# EAGLE design ProtoMole5 (EAGLE 6.6.0)
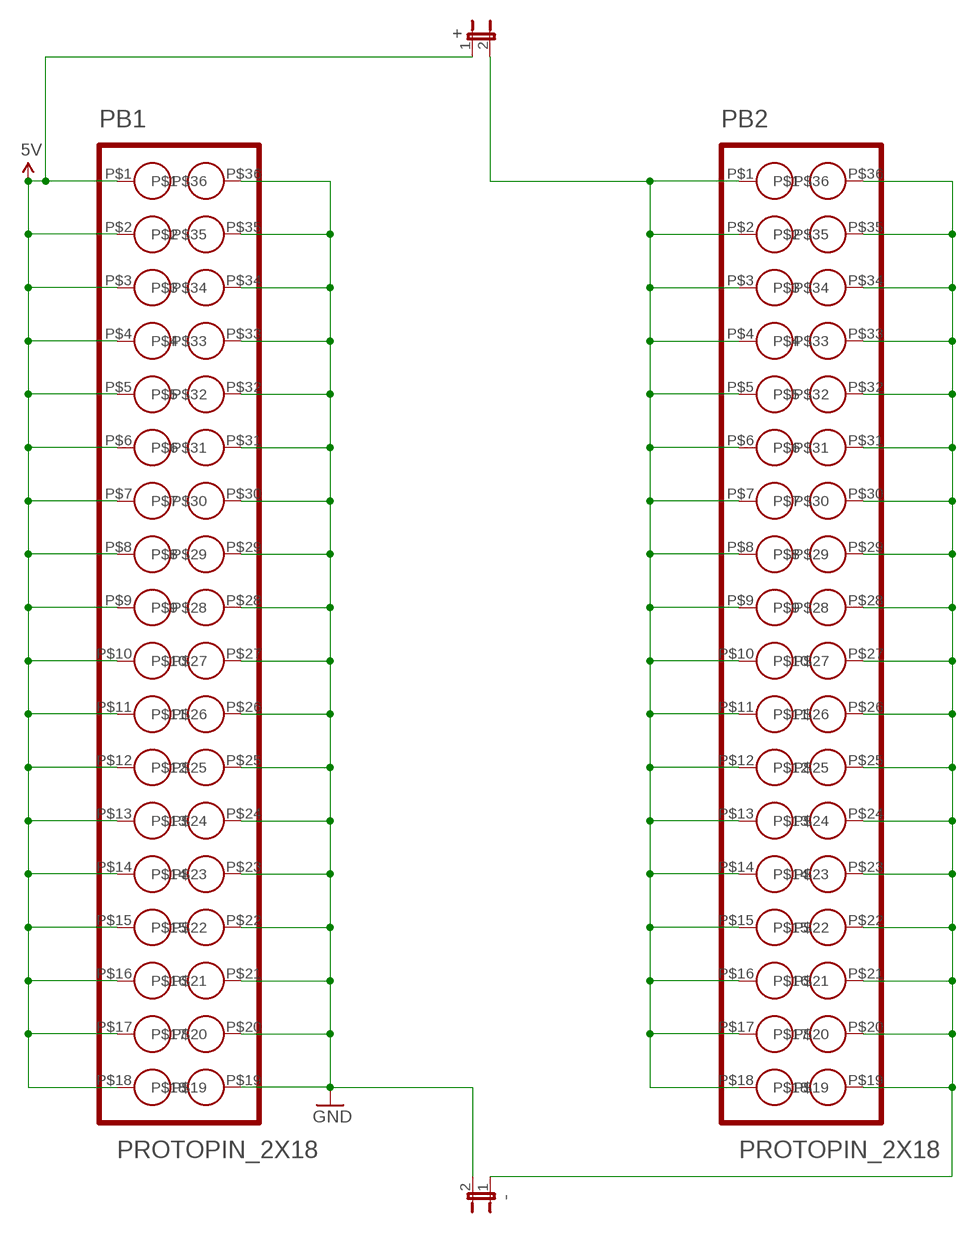
[diagram p0: schematic, sheet 1]

## Parts
+  JUMPER-2SMD-NO-NS  [SJ_2S-NO-NS]
-  JUMPER-2SMD-NO-NS  [SJ_2S-NO-NS]
PB1  PROTOPIN_2X18  [2X18_PINHEADER]
PB2  PROTOPIN_2X18  [2X18_PINHEADER]

## Nets
5V: +.1 PB1.P$1 PB1.P$2 PB1.P$3 PB1.P$4 PB1.P$5 PB1.P$6 PB1.P$7 PB1.P$8 PB1.P$9 PB1.P$10 PB1.P$11 PB1.P$12 PB1.P$13 PB1.P$14 PB1.P$15 PB1.P$16 PB1.P$17 PB1.P$18
GND: -.2 PB1.P$19 PB1.P$20 PB1.P$21 PB1.P$22 PB1.P$23 PB1.P$24 PB1.P$25 PB1.P$26 PB1.P$27 PB1.P$28 PB1.P$29 PB1.P$30 PB1.P$31 PB1.P$32 PB1.P$33 PB1.P$34 PB1.P$35 PB1.P$36
N$181: -.1 PB2.P$19 PB2.P$20 PB2.P$21 PB2.P$22 PB2.P$23 PB2.P$24 PB2.P$25 PB2.P$26 PB2.P$27 PB2.P$28 PB2.P$29 PB2.P$30 PB2.P$31 PB2.P$32 PB2.P$33 PB2.P$34 PB2.P$35 PB2.P$36
N$185: +.2 PB2.P$1 PB2.P$2 PB2.P$3 PB2.P$4 PB2.P$5 PB2.P$6 PB2.P$7 PB2.P$8 PB2.P$9 PB2.P$10 PB2.P$11 PB2.P$12 PB2.P$13 PB2.P$14 PB2.P$15 PB2.P$16 PB2.P$17 PB2.P$18

## Library data of the parts
+ - = SparkFun-Retired:JUMPER-2: Jumper Basic 0.1" spaced jumper. Use with breakaway headers.
PB1 PB2 = MarcEagleParts:PROTOPIN_2X18

## Board
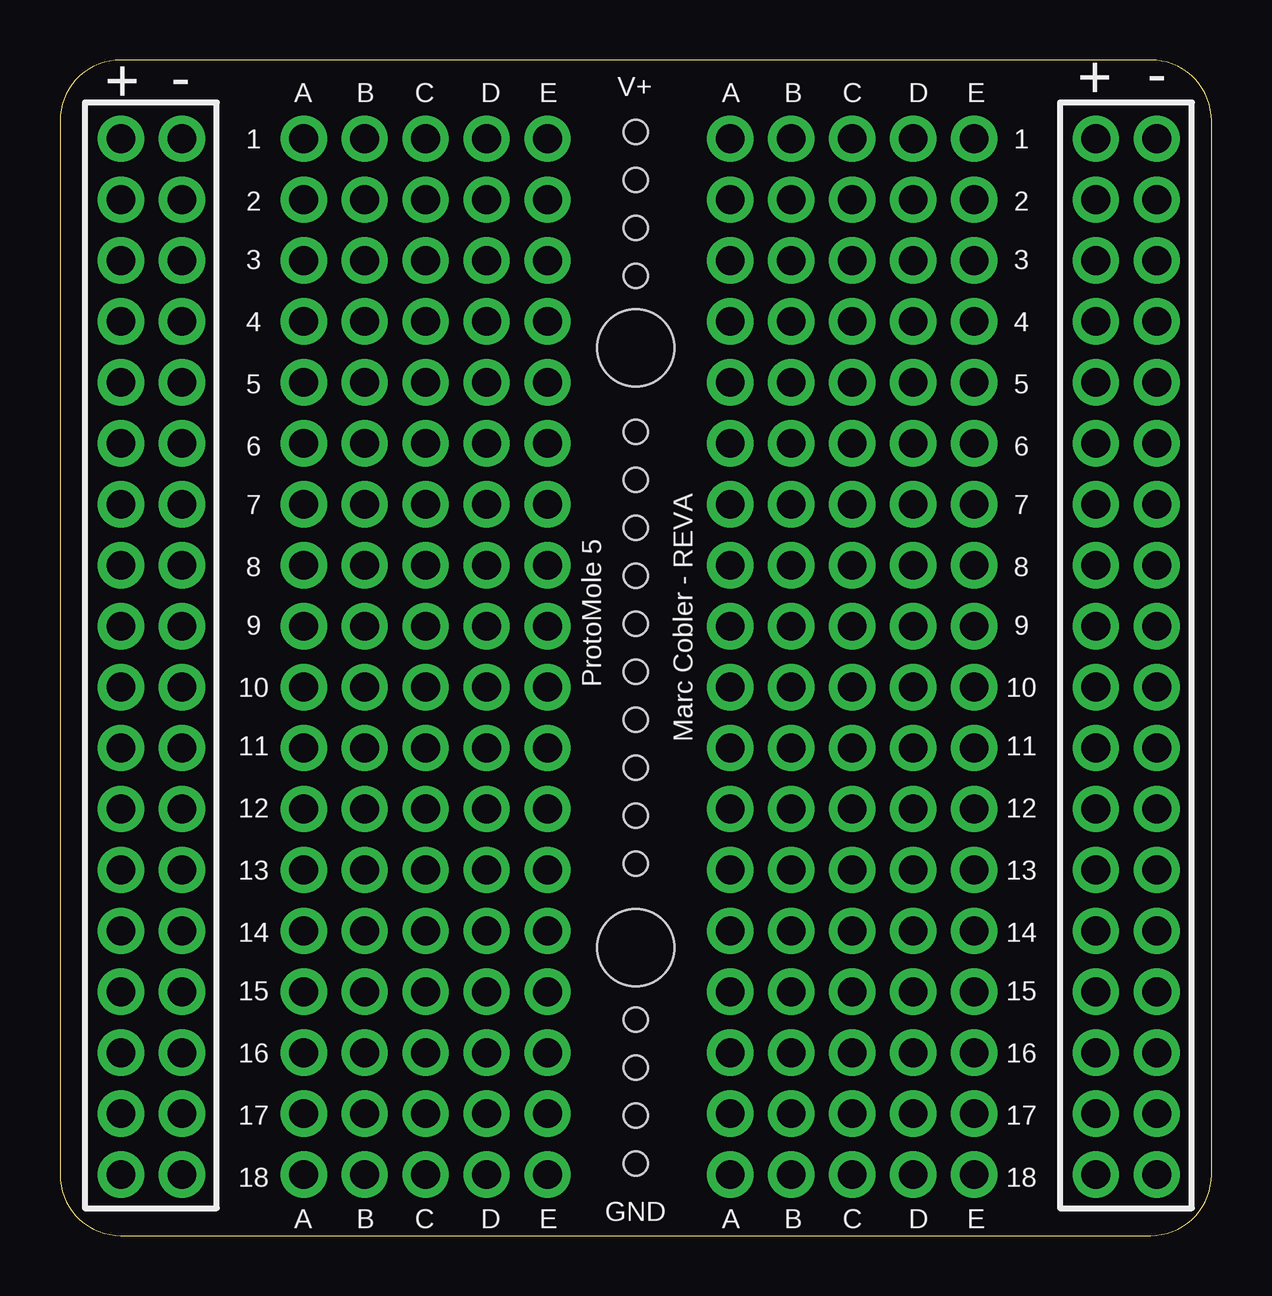
[diagram p1: board, top side]
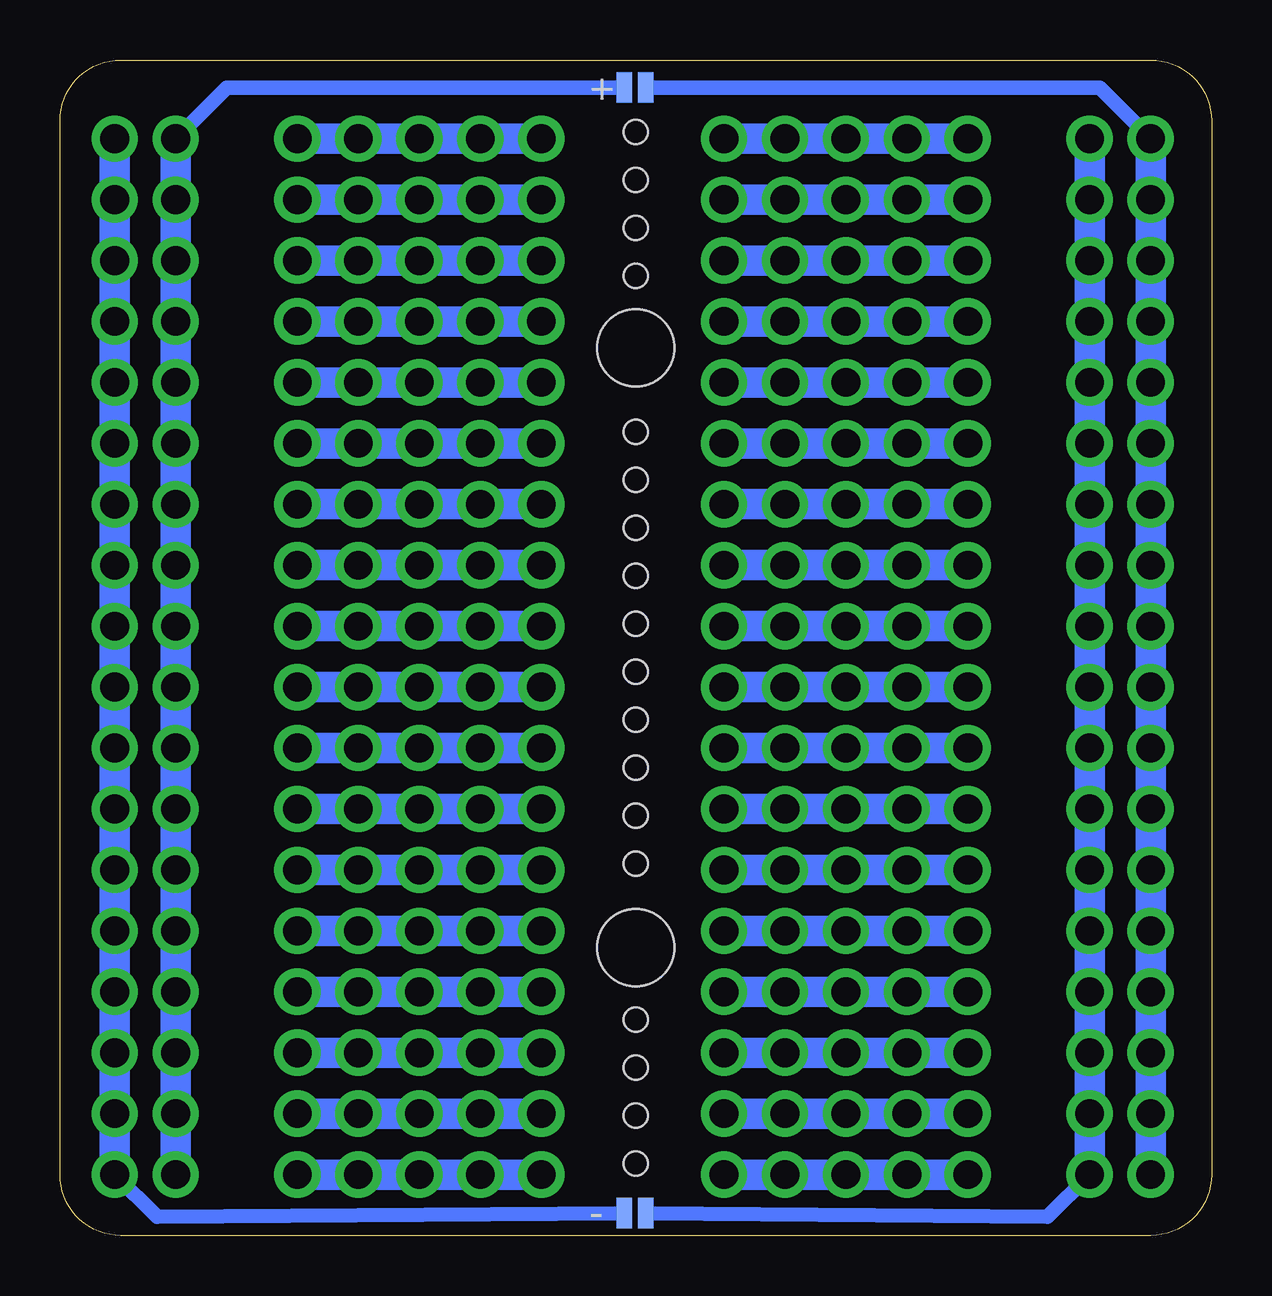
[diagram p2: board, bottom side, seen from below]

Size 48 x 49 mm. Coordinates in mm from the lower left corner, seen from the top.
Outline: 0,46.46 0,2.54 arc90 2.54,0 45.46,0 arc90 48,2.54 48,46.46 arc90 45.46,49 2.54,49 arc90 0,46.46
Copper layers (1*16): Top 0.035mm / dielectric 1.5mm / Bottom 0.035mm
Design rules "ITEADstudio_DRC": minimum track width 6mil, minimum drill 12mil, track to track 6mil, track to pad 6mil, pad to pad 6mil, via to via 6mil, smd to smd 0mil, copper to edge 10mil, drill to drill 10mil, minimum pad ring 10mil, minimum via ring 6mil, stop-mask expansion 2mil, vias tented up to drill 100mil, thermal gap 10mil
Holes 1 mm at 24,42 24,17.5 24,15.5 24,9 24,7 24,44 24,46 24,33.5 24,31.5 24,29.5 24,27.5 24,25.5 24,23.5 24,21.5 24,19.5 24,5 24,3 24,40
Holes 3.2 mm at 24,12 24,37

### Footprints (pad centres in the part's own frame; a part is rotated, then mirrored left to right if it is on the bottom)
SJ_2S-NO-NS = smd 0.635 x 1.27: 1 -0.45,0; 2 0.45,0
2X18_PINHEADER = drill 1.2 pad 1.93: P$1 0,0; P$2 2.54,0; P$3 5.08,0; P$4 7.62,0; P$5 10.16,0; P$6 12.7,0; P$7 15.24,0; P$8 17.78,0; P$9 20.32,0; P$10 22.86,0; P$11 25.4,0; P$12 27.94,0; P$13 30.48,0; P$14 33.02,0; P$15 35.56,0; P$16 38.1,0; P$17 40.64,0; P$18 43.18,0; P$19 0,2.54; P$20 2.54,2.54; P$21 5.08,2.54; P$22 7.62,2.54; P$23 10.16,2.54; P$24 12.7,2.54; P$25 15.24,2.54; P$26 17.78,2.54; P$27 20.32,2.54; P$28 22.86,2.54; P$29 25.4,2.54; P$30 27.94,2.54; P$31 30.48,2.54; P$32 33.02,2.54; P$33 35.56,2.54; P$34 38.1,2.54; P$35 40.64,2.54; P$36 43.18,2.54

### Placement (x,y rotation side)
+  24.03,47.85 180 bottom
-  24.03,0.93 0 bottom
PB1  2.54,45.72 270 top
PB2  43.18,45.72 270 top

### Tracks (layer width: path | path; a pad name or v marks a point on that pad's centre or on a via)
1  (via drill 1.2 pad 1.93)
  Bottom 1.27: v10.16,45.72 v12.7,45.72 v15.24,45.72 v17.78,45.72 v20.32,45.72
2  (via drill 1.2 pad 1.93)
  Bottom 1.27: v10.16,43.18 v12.7,43.18 v15.24,43.18 v17.78,43.18 v20.32,43.18
3  (via drill 1.2 pad 1.93)
  Bottom 1.27: v20.32,40.64 v17.78,40.64 v15.24,40.64 v12.7,40.64 v10.16,40.64
4  (via drill 1.2 pad 1.93)
  Bottom 1.27: v10.16,38.1 v12.7,38.1 v15.24,38.1 v17.78,38.1 v20.32,38.1
5  (via drill 1.2 pad 1.93)
  Bottom 1.27: v20.32,35.56 v17.78,35.56 v15.24,35.56 v12.7,35.56 v10.16,35.56
5V
  Bottom 0.61: PB1.P$1 4.67,47.85 +.1
  Bottom 1.27: PB1.P$1 PB1.P$2 PB1.P$3 PB1.P$4 PB1.P$5 PB1.P$6 PB1.P$7 PB1.P$8 PB1.P$9 PB1.P$10 PB1.P$11 PB1.P$12 PB1.P$13 PB1.P$14 PB1.P$15 PB1.P$16 PB1.P$17 PB1.P$18
6  (via drill 1.2 pad 1.93)
  Bottom 1.27: v10.16,33.02 v12.7,33.02 v15.24,33.02 v17.78,33.02 v20.32,33.02
7  (via drill 1.2 pad 1.93)
  Bottom 1.27: v20.32,30.48 v17.78,30.48 v15.24,30.48 v12.7,30.48 v10.16,30.48
8  (via drill 1.2 pad 1.93)
  Bottom 1.27: v10.16,27.94 v12.7,27.94 v15.24,27.94 v17.78,27.94 v20.32,27.94
9  (via drill 1.2 pad 1.93)
  Bottom 1.27: v20.32,25.4 v17.78,25.4 v15.24,25.4 v12.7,25.4 v10.16,25.4
10  (via drill 1.2 pad 1.93)
  Bottom 1.27: v10.16,22.86 v12.7,22.86 v15.24,22.86 v17.78,22.86 v20.32,22.86
11  (via drill 1.2 pad 1.93)
  Bottom 1.27: v20.32,20.32 v17.78,20.32 v15.24,20.32 v12.7,20.32 v10.16,20.32
12  (via drill 1.2 pad 1.93)
  Bottom 1.27: v10.16,17.78 v12.7,17.78 v15.24,17.78 v17.78,17.78 v20.32,17.78
13  (via drill 1.2 pad 1.93)
  Bottom 1.27: v20.32,15.24 v17.78,15.24 v15.24,15.24 v12.7,15.24 v10.16,15.24
14  (via drill 1.2 pad 1.93)
  Bottom 1.27: v10.16,12.7 v12.7,12.7 v15.24,12.7 v17.78,12.7 v20.32,12.7
15  (via drill 1.2 pad 1.93)
  Bottom 1.27: v20.32,10.16 v17.78,10.16 v15.24,10.16 v12.7,10.16 v10.16,10.16
16  (via drill 1.2 pad 1.93)
  Bottom 1.27: v10.16,7.62 v12.7,7.62 v15.24,7.62 v17.78,7.62 v20.32,7.62
17  (via drill 1.2 pad 1.93)
  Bottom 1.27: v20.32,5.08 v17.78,5.08 v15.24,5.08 v12.7,5.08 v10.16,5.08
18  (via drill 1.2 pad 1.93)
  Bottom 1.27: v10.16,2.54 v12.7,2.54 v15.24,2.54 v17.78,2.54 v20.32,2.54
19  (via drill 1.2 pad 1.93)
  Bottom 1.27: v27.94,45.72 v30.48,45.72 v33.02,45.72 v35.56,45.72 v38.1,45.72
20  (via drill 1.2 pad 1.93)
  Bottom 1.27: v38.1,43.18 v35.56,43.18 v33.02,43.18 v30.48,43.18 v27.94,43.18
21  (via drill 1.2 pad 1.93)
  Bottom 1.27: v27.94,40.64 v30.48,40.64 v33.02,40.64 v35.56,40.64 v38.1,40.64
22  (via drill 1.2 pad 1.93)
  Bottom 1.27: v38.1,38.1 v35.56,38.1 v33.02,38.1 v30.48,38.1 v27.94,38.1
23  (via drill 1.2 pad 1.93)
  Bottom 1.27: v27.94,35.56 v30.48,35.56 v33.02,35.56 v35.56,35.56 v38.1,35.56
24  (via drill 1.2 pad 1.93)
  Bottom 1.27: v38.1,33.02 v35.56,33.02 v33.02,33.02 v30.48,33.02 v27.94,33.02
25  (via drill 1.2 pad 1.93)
  Bottom 1.27: v27.94,30.48 v30.48,30.48 v33.02,30.48 v35.56,30.48 v38.1,30.48
26  (via drill 1.2 pad 1.93)
  Bottom 1.27: v38.1,27.94 v35.56,27.94 v33.02,27.94 v30.48,27.94 v27.94,27.94
27  (via drill 1.2 pad 1.93)
  Bottom 1.27: v27.94,25.4 v30.48,25.4 v33.02,25.4 v35.56,25.4 v38.1,25.4
28  (via drill 1.2 pad 1.93)
  Bottom 1.27: v38.1,22.86 v35.56,22.86 v33.02,22.86 v30.48,22.86 v27.94,22.86
29  (via drill 1.2 pad 1.93)
  Bottom 1.27: v27.94,20.32 v30.48,20.32 v33.02,20.32 v35.56,20.32 v38.1,20.32
30  (via drill 1.2 pad 1.93)
  Bottom 1.27: v38.1,17.78 v35.56,17.78 v33.02,17.78 v30.48,17.78 v27.94,17.78
31  (via drill 1.2 pad 1.93)
  Bottom 1.27: v27.94,15.24 v30.48,15.24 v33.02,15.24 v35.56,15.24 v38.1,15.24
32  (via drill 1.2 pad 1.93)
  Bottom 1.27: v38.1,12.7 v35.56,12.7 v33.02,12.7 v30.48,12.7 v27.94,12.7
33  (via drill 1.2 pad 1.93)
  Bottom 1.27: v27.94,10.16 v30.48,10.16 v33.02,10.16 v35.56,10.16 v38.1,10.16
34  (via drill 1.2 pad 1.93)
  Bottom 1.27: v38.1,7.62 v35.56,7.62 v33.02,7.62 v30.48,7.62 v27.94,7.62
35  (via drill 1.2 pad 1.93)
  Bottom 1.27: v27.94,5.08 v30.48,5.08 v33.02,5.08 v35.56,5.08 v38.1,5.08
36  (via drill 1.2 pad 1.93)
  Bottom 1.27: v38.1,2.54 v35.56,2.54 v33.02,2.54 v30.48,2.54 v27.94,2.54
GND
  Bottom 0.61: PB1.P$36 6.84,0.78 -.2
  Bottom 1.27: PB1.P$19 PB1.P$20 PB1.P$21 PB1.P$22 PB1.P$23 PB1.P$24 PB1.P$25 PB1.P$26 PB1.P$27 PB1.P$28 PB1.P$29 PB1.P$30 PB1.P$31 PB1.P$32 PB1.P$33 PB1.P$34 PB1.P$35 PB1.P$36
N$181
  Bottom 0.61: PB2.P$36 43.96,0.78 -.1
  Bottom 1.27: PB2.P$19 PB2.P$20 PB2.P$21 PB2.P$22 PB2.P$23 PB2.P$24 PB2.P$25 PB2.P$26 PB2.P$27 PB2.P$28 PB2.P$29 PB2.P$30 PB2.P$31 PB2.P$32 PB2.P$33 PB2.P$34 PB2.P$35 PB2.P$36
N$185
  Bottom 0.61: PB2.P$1 41.05,47.85 +.2
  Bottom 1.27: PB2.P$1 PB2.P$2 PB2.P$3 PB2.P$4 PB2.P$5 PB2.P$6 PB2.P$7 PB2.P$8 PB2.P$9 PB2.P$10 PB2.P$11 PB2.P$12 PB2.P$13 PB2.P$14 PB2.P$15 PB2.P$16 PB2.P$17 PB2.P$18

### Text on the board
tPlace: + | - | V+ | + | - | A | B | C | D | E | A | B | C | D | E | 1 | 1 | 2 | 2 | 3 | 3 | 4 | 4 | 5 | 5 | 6 | 6 | 7 | 7 | 8 | 8 | 9 | 9 | 10 | ProtoMole 5 | 10 | Marc Cobler - REVA | 11 | 11 | 12 | 12 | 13 | 13 | 14 | 14 | 15 | 15 | 16 | 16 | 17 | 17 | 18 | 18 | GND | A | B | C | D | E | A | B | C | D | E